# Altium schematic sheet 13.SchDoc
size 297 x 209 mm
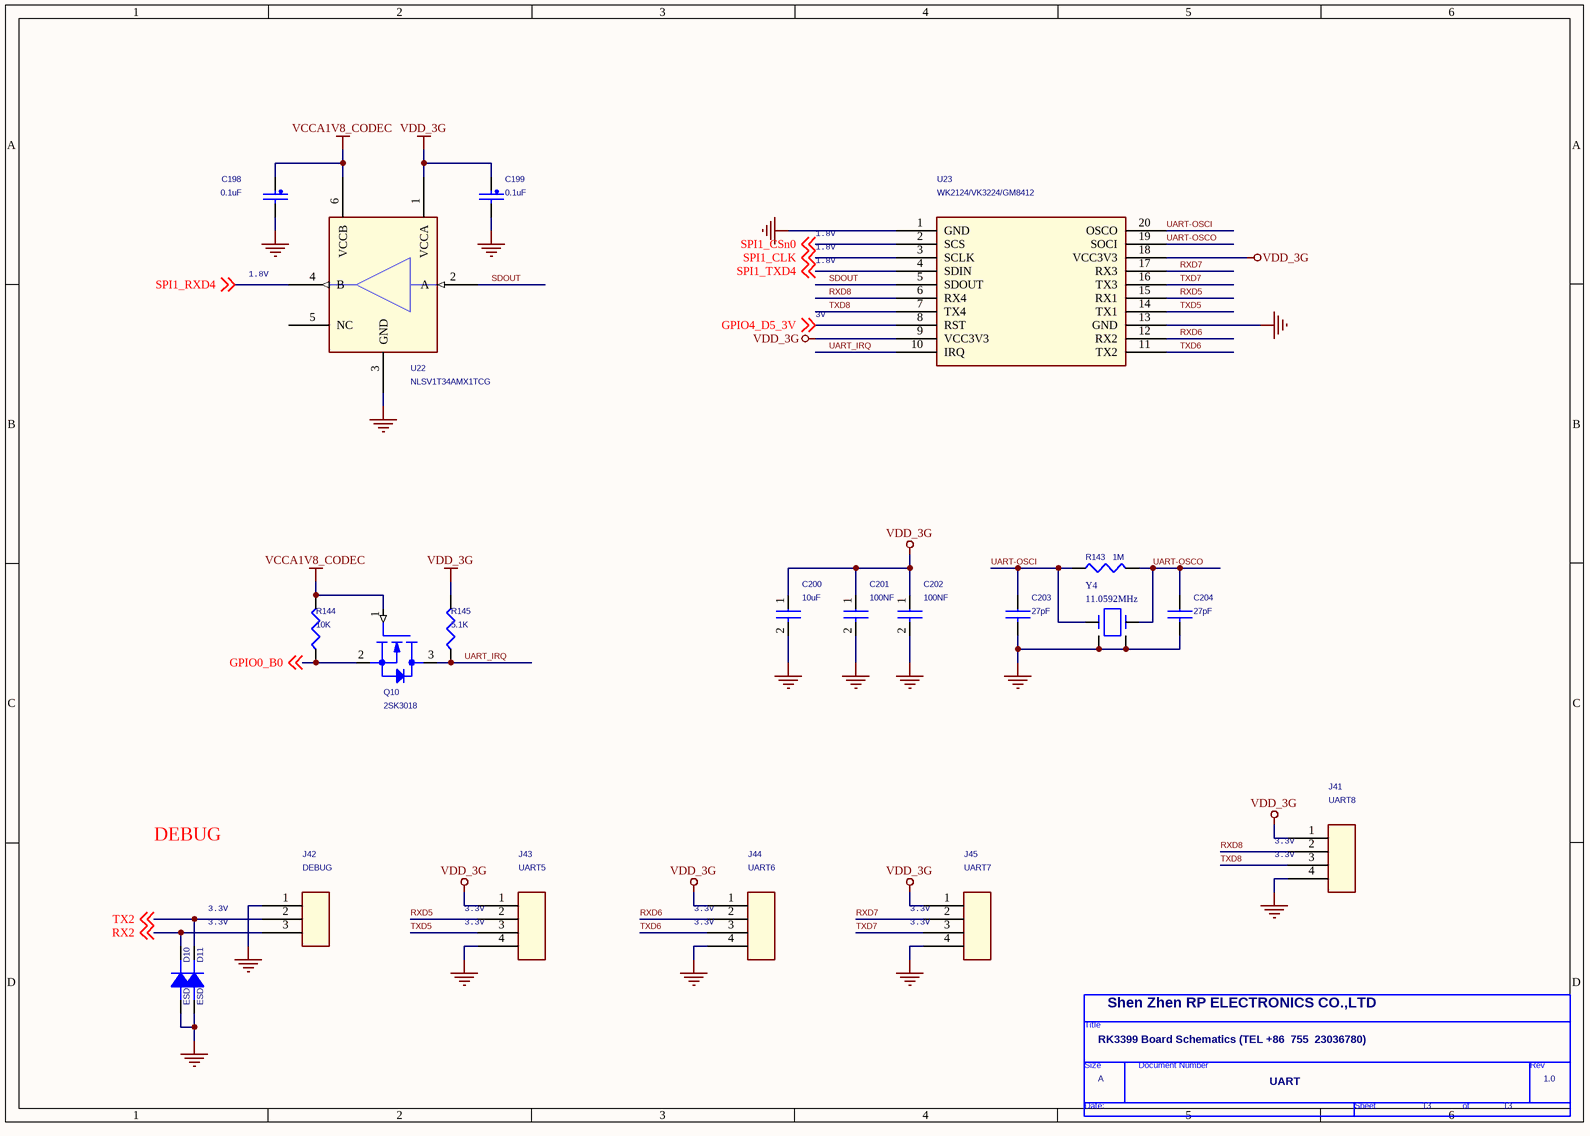
[diagram p0: 13.SchDoc]

## Parts
*  Doc: UART  RevCode: 1.0  Title: RK3399 Board Schematics (TEL +86  755  23036780)  Page Size: A  Page Number: 13  Cage Code: Shen Zhen RP ELECTRONICS CO.,LTD  (hidden comment: TitleBlock0)  (graphical)
C198  0.1uF  [0805C]
C199  0.1uF  [0805C]
C200  10uF  [0805C]
C201  100NF  [0805C]
C202  100NF  [0805C]
C203  27pF  [0805C]
C204  27pF  [0805C]
D10  ESD  [SOD-323]
D11  ESD  [SOD-323]
J41  UART8  [sip-4p-2d0]
J42  DEBUG  [SIP-3P-2D54-DEBUG]
J43  UART5  [sip-4p-2d0]
J44  UART6  [sip-4p-2d0]
J45  UART7  [sip-4p-2d0]
Q10  2SK3018  [SOT-23]
R143  1M  [0805]
R144  10K  [0805]
R145  5.1K  [0805]
U22  NLSV1T34AMX1TCG  [ullga6_1p45x1_0p5mm]
U23  WK2124/VK3224/GM8412  [WK2124]
Y4  11.0592MHz  [Y3025]

## Nets
GND: C198.2 C199.2 C200.2 C201.2 C202.2 C203.2 C204.2 D10.1(A) D11.1(A) J41.4 J42.1 J43.4 J44.4 J45.4 U22.3(GND) U23.1(GND) U23.13(GND) Y4.2 Y4.4
VCCA1V8_CODEC: C198.1 Q10.1(GATE) R144.1 U22.6(VCCB)
VDD_3G: C199.1 C200.1 C201.1 C202.1 J41.1 J43.1 J44.1 J45.1 R145.1 U22.1(VCCA) U23.9(VCC3V3) U23.18(VCC3V3)
GPIO0_B0: Q10.2(SOURCE) R144.2 ; off-sheet GPIO0_B0
GPIO4_D5_3V: U23.8(RST) ; off-sheet GPIO4_D5_3V
RX2: D10.2(K) J42.3 ; off-sheet RX2
RXD5: J43.2 U23.15(RX1)
RXD6: J44.2 U23.12(RX2)
RXD7: J45.2 U23.17(RX3)
RXD8: J41.2 U23.6(RX4)
SDOUT: U22.2(A) U23.5(SDOUT)
SPI1_CLK: U23.3(SCLK) ; off-sheet SPI1_CLK
SPI1_CSn0: U23.2(SCS) ; off-sheet SPI1_CSn0
SPI1_RXD4: U22.4(B) ; off-sheet SPI1_RXD4
SPI1_TXD4: U23.4(SDIN) ; off-sheet SPI1_TXD4
TX2: D11.2(K) J42.2 ; off-sheet TX2
TXD5: J43.3 U23.14(TX1)
TXD6: J44.3 U23.11(TX2)
TXD7: J45.3 U23.16(TX3)
TXD8: J41.3 U23.7(TX4)
UART-OSCI: C203.1 R143.2 U23.20(OSCO) Y4.1
UART-OSCO: C204.1 R143.1 U23.19(SOCI) Y4.3
UART_IRQ: Q10.3(DRAIN) R145.2 U23.10(IRQ)

Not connected (* = marked no-connect by the designer): U22 5(NC)

## Notes on the sheet
- 1.8V
- 3V
- DEBUG
- (near J41) 3.3V
- 3.3V
- (near J43) 3.3V
- (near J44) 3.3V
- (near J45) 3.3V
- (in symbol TitleBlock0) Title; Size; Document Number; Rev; Date:; Sheet; of

## Library data of the parts
C198 = CAP_NP: CAP CER 0.22UF 6.3V 20% X5R 0201; CLASS: DISCRETE; SIGNAL_MODEL: DEFAULT_CAPACITOR_220000pF_2_1; ROOM: CPU; AGILE_PN: 150-77852; MFG_NAME01: TAIYO YUDEN; MFG_PN01: JMK063BJ224MP-F; CAD_APPROVED: Yes; FPLIST: CC0201,CC0201_HD,0201_CC,cc_0201_cir; PRIORITY_PN: 021-00278; Tolerance: 20%; ROHS: Yes; HEIGHT: 0.33 MM; WVDC: 6.3V; VOLTAGE: 6.3V
C199 = CAP_NP: CAP CER 0.22UF 10V 20% X5R 0201; CLASS: DISCRETE; ROOM: CPU; AGILE_PN: 150-78815; MFG_NAME01: Taiyo Yuden; MFG_PN01: LMK063BJ224MP-F; CAD_APPROVED: Yes; FPLIST: CC0201,CC0201_HD,0201_CC,CC_0201_CIR,0201_CC_012SM; PRIORITY_PN: 021-00278; SIGNAL_MODEL: DEFAULT_CAPACITOR_220000pF_2_1; VOLTAGE: 10V; Tolerance: 20%; ROHS: Yes; HEIGHT: 0.33MM; WVDC: 10V
C200 = CAP NP_Dup2: cap,10.00uF,+/-10%,10V,X5R,C0805; Manufacturer: TDK; RK PN: C2012X5R1A106K125AB; Priority: A; Tolerance: 10%; Voltage: 10V; Dielectric: X5R; Part Type: C0805; Manufacturer PN: C2012X5R1A106K125AB; Created by: JJJ
C201 C202 = CAP NP_Dup2: cap,100.00nF,+/-10%,16V,X5R,C0402; Manufacturer PN: C1005X5R1C104K050BA; Manufacturer: TDK; Tolerance: 10%; Priority: A; Voltage: 16V; Dielectric: X5R; Created by: JJJ; Part Type: C0402; RK PN: C1005X5R1C104K050BA
C203 C204 = CAP NP_3_Dup1
D10 D11 = DIODE_Dup2
J41 J43-J45 = CON4
J42 = CON4_1
Q10 = 2N6756_0
R143 = RES_0
R144 R145 = R_Dup1
U22 = NLSV1T34: IC VXLTR 1 BIT DUAL-SUPPLY 0.9-4.5V 613AF; AGILE_PN: 312-79552; MFG_NAME01: On Semiconductor; CAD_APPROVED: Yes; CLASS: IC; MFG_PN01: NLSV1T34AMX1TCG; ROHS: Yes; HEIGHT: 0.4MM
Y4 = CRYSTAL_2
* = TitleBlock0: Page Create Date: March  8, 1995; Page Count: 13